# EAGLE design H00R40 (EAGLE 8.7.1)
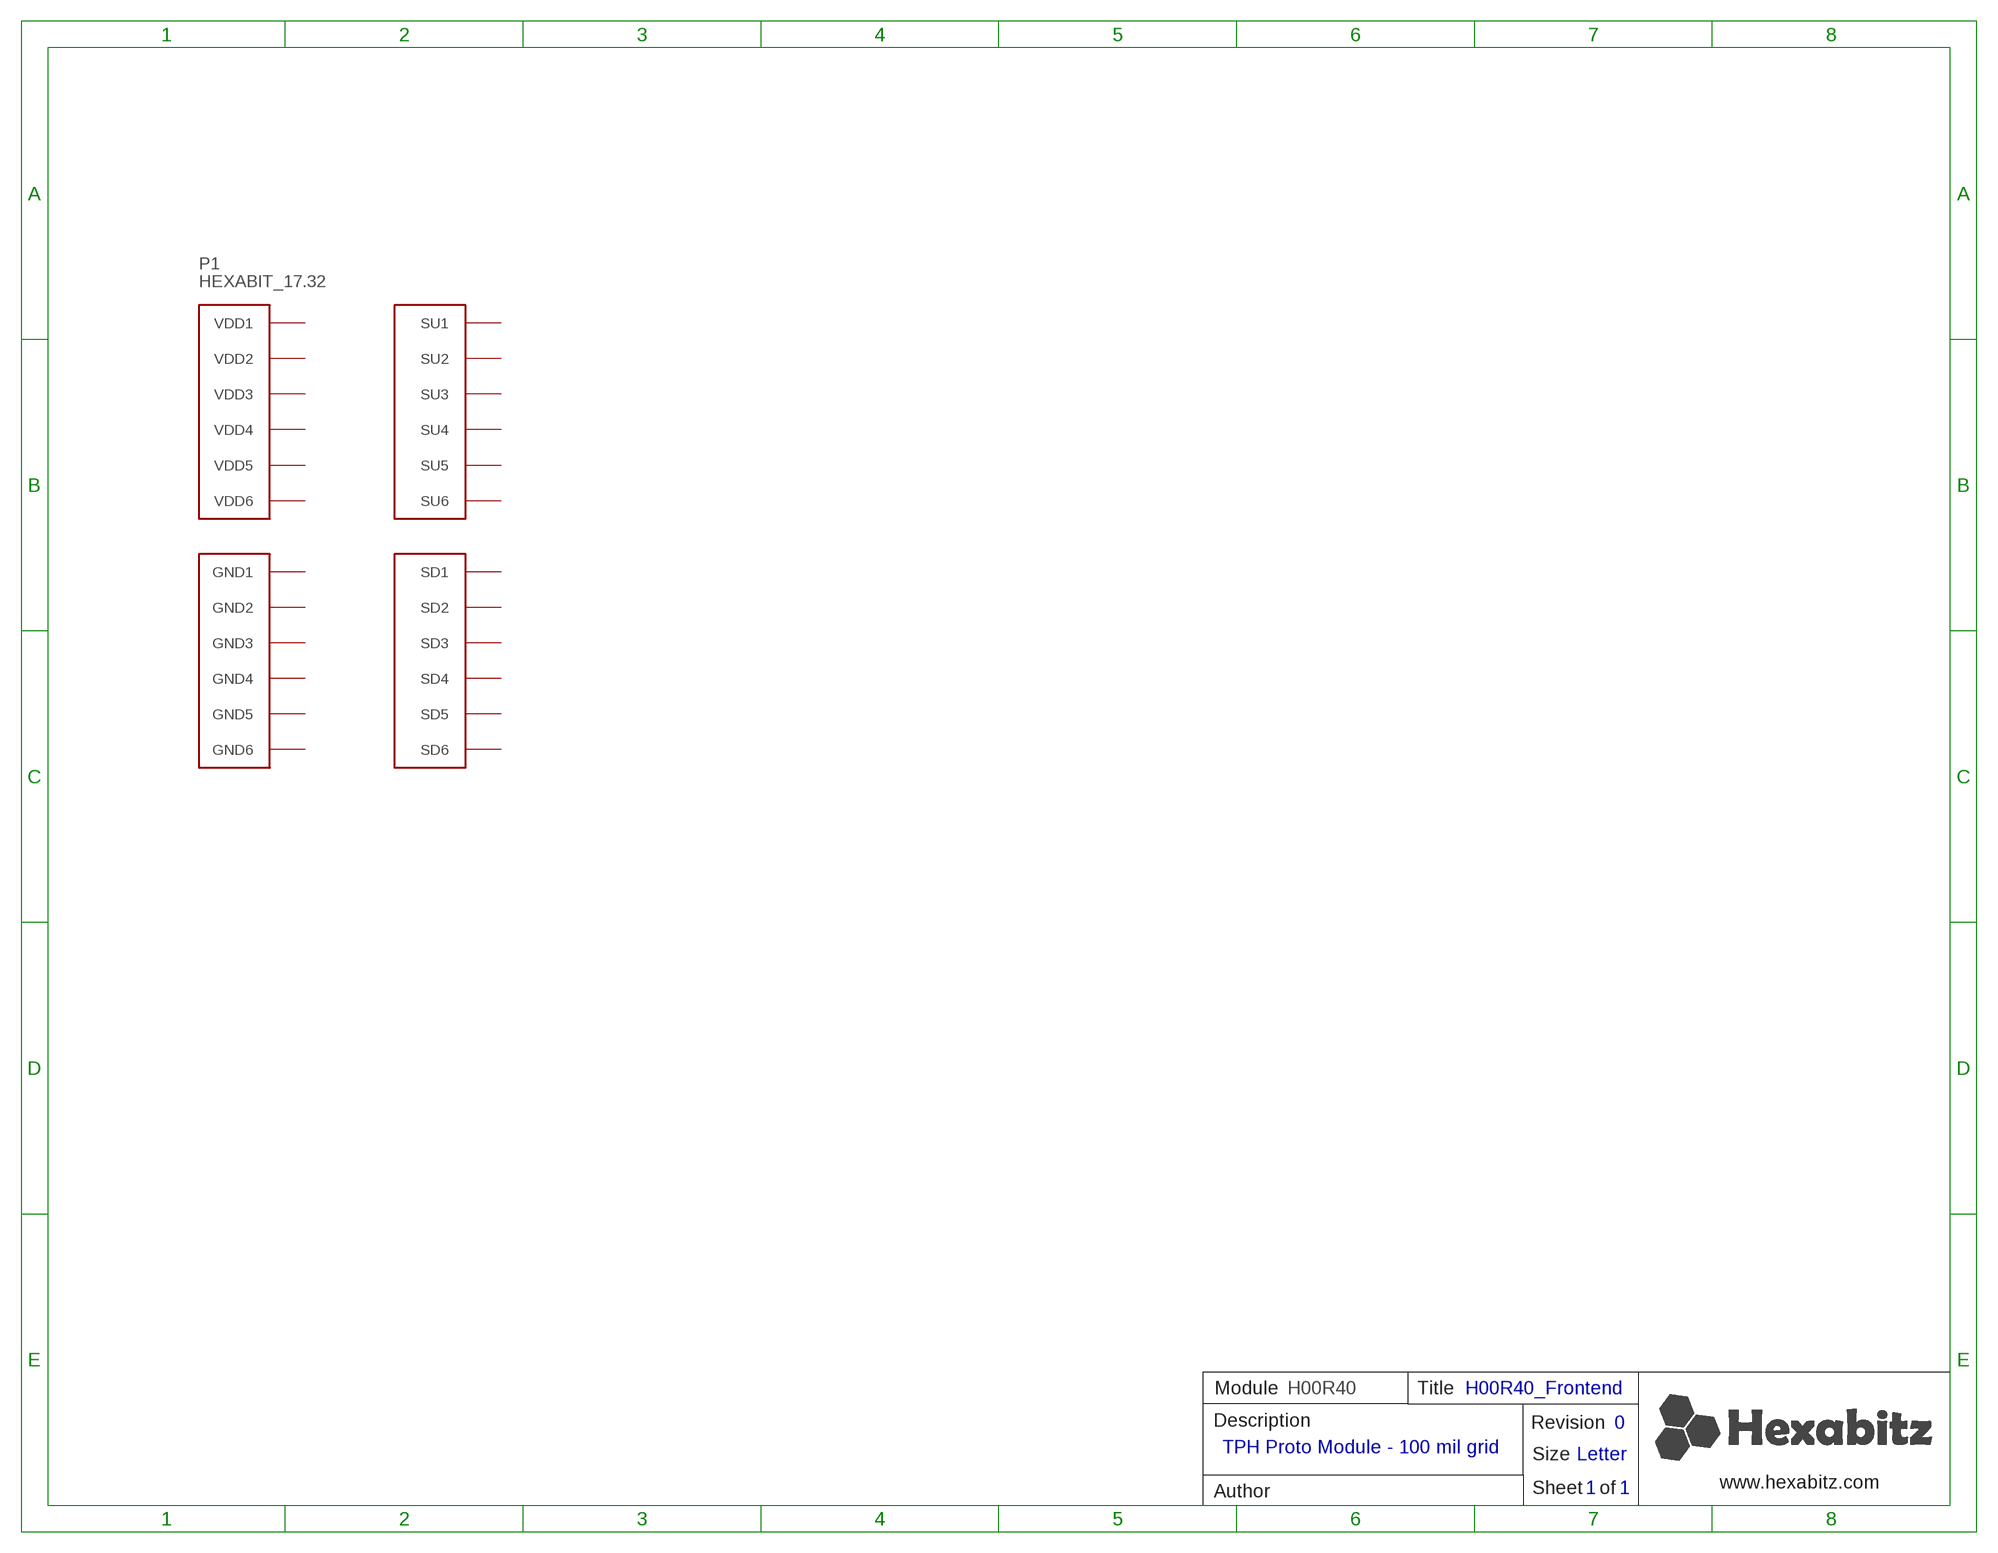
[diagram p0: schematic, sheet 1]

## Parts
P1  HEXABIT_17.32  [HEXABIT_17.32]
Unconnected: P1.PAD_PD1(SD1) P1.PAD_PD2(SD2) P1.PAD_PD3(SD3) P1.PAD_PD4(SD4) P1.PAD_PD5(SD5) P1.PAD_PD6(SD6) P1.PAD_PU1(SU1) P1.PAD_PU2(SU2) P1.PAD_PU3(SU3) P1.PAD_PU4(SU4) P1.PAD_PU5(SU5) P1.PAD_PU6(SU6)

## Notes on the sheet
- Module | H00R40 | Title | H00R40_Frontend
- Description | Revision | 0
- TPH Proto Module - 100 mil grid
- Size | Letter
- www.hexabitz.com
- Author | Sheet   of | 1 | 1

## Power pins joined to a net without a drawn wire
GND1: P1.PAD_PD7(GND1)
GND2: P1.PAD_PD8(GND2)
GND3: P1.PAD_PD9(GND3)
GND4: P1.PAD_PD10(GND4)
GND5: P1.PAD_PD11(GND5)
GND6: P1.PAD_PD12(GND6)
VDD1: P1.PAD_PU7(VDD1)
VDD2: P1.PAD_PU8(VDD2)
VDD3: P1.PAD_PU9(VDD3)
VDD4: P1.PAD_PU10(VDD4)
VDD5: P1.PAD_PU11(VDD5)
VDD6: P1.PAD_PU12(VDD6)

## Library data of the parts
P1 = hexabitz_connectors:HEXABIT_?: Hexabitz Hexagon Module Connector Hexagon side length = 17.32mm.

## Board
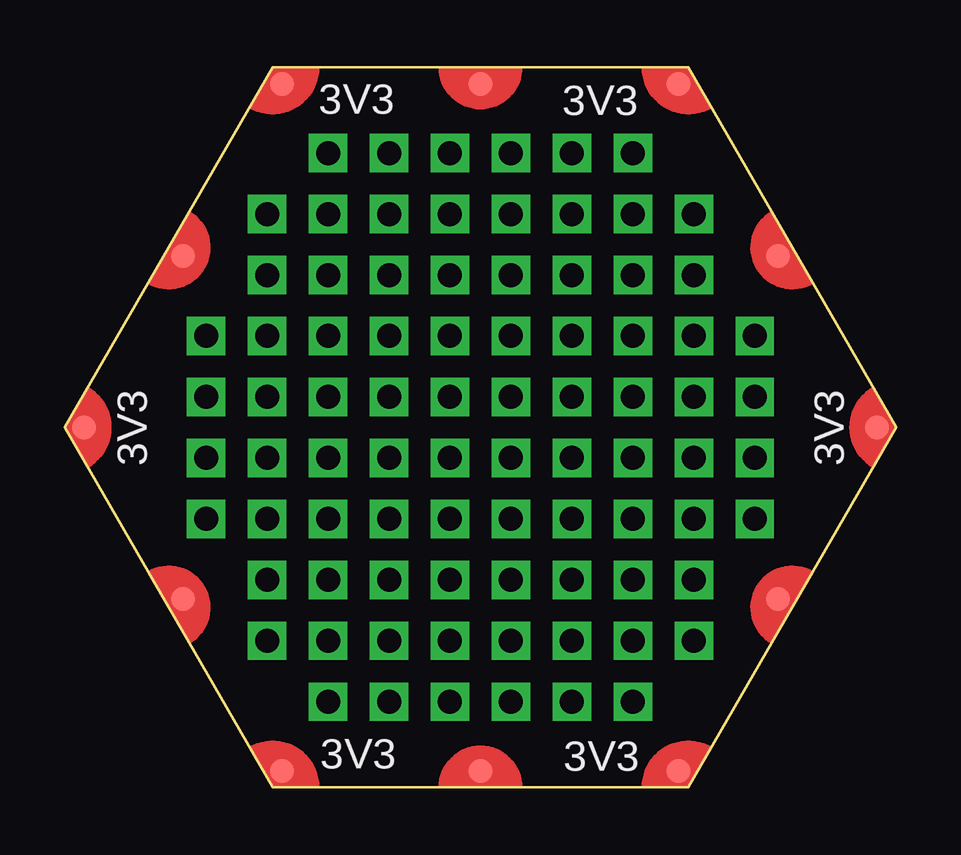
[diagram p1: board, top side]
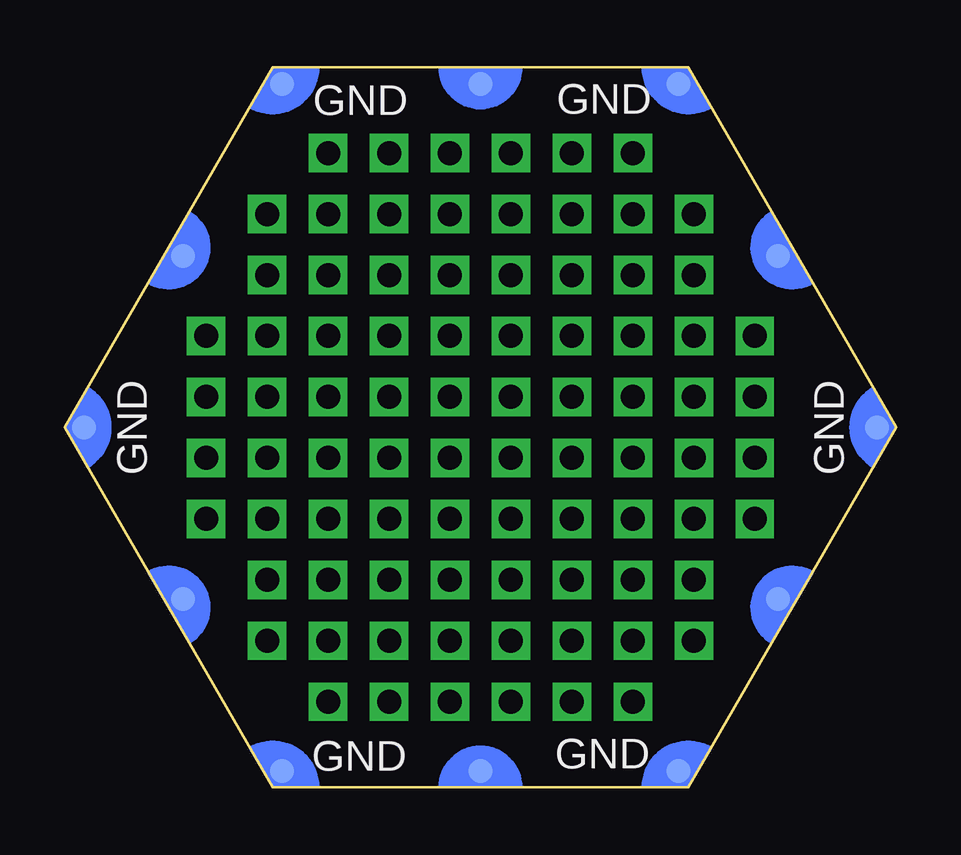
[diagram p2: board, bottom side, seen from below]

Size 34.64 x 30 mm. Coordinates in mm from the lower left corner, seen from the top.
Copper layers (1*16): Top 0.035mm / dielectric 1.5mm / Bottom 0.035mm
Design rules "2_layer *": minimum track width 7mil, minimum drill 10mil, track to track 6mil, track to pad 32mil, pad to pad 32mil, via to via 6mil, smd to smd 0mil, copper to edge 1mil, drill to drill 8mil, minimum pad ring 10mil, minimum via ring 8mil, stop-mask expansion 2mil, vias tented up to drill 15mil, thermal gap 10mil

### Footprints (pad centres in the part's own frame; a part is rotated, then mirrored left to right if it is on the bottom)
HEXABIT_17.32 = smd 1 x 1 bottom: PAD_PD1 12.39,7.15; PAD_PD2 12.39,-7.15; PAD_PD3 0,-14.31; PAD_PD4 -12.39,-7.15; PAD_PD5 -12.39,7.15; PAD_PD6 0,14.31; PAD_PD7 8.26,14.31; PAD_PD8 16.52,0; PAD_PD9 8.26,-14.31; PAD_PD10 -8.26,-14.31; PAD_PD11 -16.52,0; PAD_PD12 -8.26,14.31 | smd 1 x 1: PAD_PU1 12.39,7.15; PAD_PU2 12.39,-7.15; PAD_PU3 0,-14.31; PAD_PU4 -12.39,-7.15; PAD_PU5 -12.39,7.15; PAD_PU6 0,14.31; PAD_PU7 8.26,14.31; PAD_PU8 16.52,0; PAD_PU9 8.26,-14.31; PAD_PU10 -8.26,-14.31; PAD_PU11 -16.52,0; PAD_PU12 -8.26,14.31

### Placement (x,y rotation side)
P1  17.32,15 0 top

### Tracks (layer width: path | path; a pad name or v marks a point on that pad's centre or on a via)
N$12  (via drill 1 pad 1.6)
  other vias: 16.05,16.27
N$13  (via drill 1 pad 1.6)
  other vias: 16.05,13.73
N$14  (via drill 1 pad 1.6)
  other vias: 18.59,16.27
N$15  (via drill 1 pad 1.6)
  other vias: 18.59,13.73
N$16  (via drill 1 pad 1.6)
  other vias: 13.51,13.73
N$17  (via drill 1 pad 1.6)
  other vias: 10.97,13.73
N$18  (via drill 1 pad 1.6)
  other vias: 8.43,13.73
N$19  (via drill 1 pad 1.6)
  other vias: 5.89,13.73
N$20  (via drill 1 pad 1.6)
  other vias: 5.89,16.27
N$21  (via drill 1 pad 1.6)
  other vias: 8.43,16.27
N$22  (via drill 1 pad 1.6)
  other vias: 10.97,16.27
N$23  (via drill 1 pad 1.6)
  other vias: 13.51,16.27
N$24  (via drill 1 pad 1.6)
  other vias: 21.13,16.27
N$25  (via drill 1 pad 1.6)
  other vias: 23.67,16.27
N$26  (via drill 1 pad 1.6)
  other vias: 26.21,16.27
N$27  (via drill 1 pad 1.6)
  other vias: 28.75,16.27
N$28  (via drill 1 pad 1.6)
  other vias: 28.75,13.73
N$29  (via drill 1 pad 1.6)
  other vias: 26.21,13.73
N$30  (via drill 1 pad 1.6)
  other vias: 23.67,13.73
N$31  (via drill 1 pad 1.6)
  other vias: 21.13,13.73
N$32  (via drill 1 pad 1.6)
  other vias: 10.97,18.81
N$33  (via drill 1 pad 1.6)
  other vias: 8.43,18.81
N$34  (via drill 1 pad 1.6)
  other vias: 13.51,18.81
N$35  (via drill 1 pad 1.6)
  other vias: 16.05,18.81
N$36  (via drill 1 pad 1.6)
  other vias: 18.59,18.81
N$37  (via drill 1 pad 1.6)
  other vias: 21.13,18.81
N$38  (via drill 1 pad 1.6)
  other vias: 23.67,18.81
N$39  (via drill 1 pad 1.6)
  other vias: 26.21,18.81
N$40  (via drill 1 pad 1.6)
  other vias: 8.43,11.19
N$41  (via drill 1 pad 1.6)
  other vias: 10.97,11.19
N$42  (via drill 1 pad 1.6)
  other vias: 13.51,11.19
N$43  (via drill 1 pad 1.6)
  other vias: 16.05,11.19
N$44  (via drill 1 pad 1.6)
  other vias: 18.59,11.19
N$45  (via drill 1 pad 1.6)
  other vias: 21.13,11.19
N$46  (via drill 1 pad 1.6)
  other vias: 23.67,11.19
N$47  (via drill 1 pad 1.6)
  other vias: 26.21,11.19
N$48  (via drill 1 pad 1.6)
  other vias: 10.97,8.65
N$49  (via drill 1 pad 1.6)
  other vias: 13.51,8.65
N$50  (via drill 1 pad 1.6)
  other vias: 16.05,8.65
N$51  (via drill 1 pad 1.6)
  other vias: 18.59,8.65
N$52  (via drill 1 pad 1.6)
  other vias: 21.13,8.65
N$53  (via drill 1 pad 1.6)
  other vias: 23.67,8.65
N$54  (via drill 1 pad 1.6)
  other vias: 10.97,21.35
N$55  (via drill 1 pad 1.6)
  other vias: 13.51,21.35
N$56  (via drill 1 pad 1.6)
  other vias: 16.05,21.35
N$57  (via drill 1 pad 1.6)
  other vias: 18.59,21.35
N$58  (via drill 1 pad 1.6)
  other vias: 21.13,21.35
N$59  (via drill 1 pad 1.6)
  other vias: 23.67,21.35
N$60  (via drill 1 pad 1.6)
  other vias: 23.67,23.89
N$61  (via drill 1 pad 1.6)
  other vias: 21.13,23.89
N$62  (via drill 1 pad 1.6)
  other vias: 18.59,23.89
N$63  (via drill 1 pad 1.6)
  other vias: 16.05,23.89
N$64  (via drill 1 pad 1.6)
  other vias: 13.51,23.89
N$65  (via drill 1 pad 1.6)
  other vias: 10.97,23.89
N$66  (via drill 1 pad 1.6)
  other vias: 10.97,26.43
N$67  (via drill 1 pad 1.6)
  other vias: 13.51,26.43
N$68  (via drill 1 pad 1.6)
  other vias: 16.05,26.43
N$69  (via drill 1 pad 1.6)
  other vias: 18.59,26.43
N$70  (via drill 1 pad 1.6)
  other vias: 21.13,26.43
N$71  (via drill 1 pad 1.6)
  other vias: 23.67,26.43
N$72  (via drill 1 pad 1.6)
  other vias: 8.43,21.35
N$73  (via drill 1 pad 1.6)
  other vias: 26.21,21.35
N$74  (via drill 1 pad 1.6)
  other vias: 26.21,23.89
N$75  (via drill 1 pad 1.6)
  other vias: 8.43,23.89
N$76  (via drill 1 pad 1.6)
  other vias: 8.43,8.65
N$77  (via drill 1 pad 1.6)
  other vias: 8.43,6.11
N$78  (via drill 1 pad 1.6)
  other vias: 10.97,6.11
N$79  (via drill 1 pad 1.6)
  other vias: 13.51,6.11
N$80  (via drill 1 pad 1.6)
  other vias: 16.05,6.11
N$81  (via drill 1 pad 1.6)
  other vias: 18.59,6.11
N$82  (via drill 1 pad 1.6)
  other vias: 21.13,6.11
N$83  (via drill 1 pad 1.6)
  other vias: 23.67,6.11
N$84  (via drill 1 pad 1.6)
  other vias: 26.21,6.11
N$85  (via drill 1 pad 1.6)
  other vias: 26.21,8.65
N$86  (via drill 1 pad 1.6)
  other vias: 23.67,3.57
N$87  (via drill 1 pad 1.6)
  other vias: 21.13,3.57
N$88  (via drill 1 pad 1.6)
  other vias: 18.59,3.57
N$89  (via drill 1 pad 1.6)
  other vias: 16.05,3.57
N$90  (via drill 1 pad 1.6)
  other vias: 13.51,3.57
N$91  (via drill 1 pad 1.6)
  other vias: 10.97,3.57
N$92  (via drill 1 pad 1.6)
  other vias: 5.89,11.19
N$93  (via drill 1 pad 1.6)
  other vias: 5.89,18.81
N$94  (via drill 1 pad 1.6)
  other vias: 28.75,18.81
N$95  (via drill 1 pad 1.6)
  other vias: 28.75,11.19

### Text on the board
tPlace: 3V3 | 3V3 | 3V3 | 3V3 | 3V3 | 3V3
bPlace: GND | GND | GND | GND | GND | GND